# EAGLE schematic bs_prod (EAGLE 6.5.0)
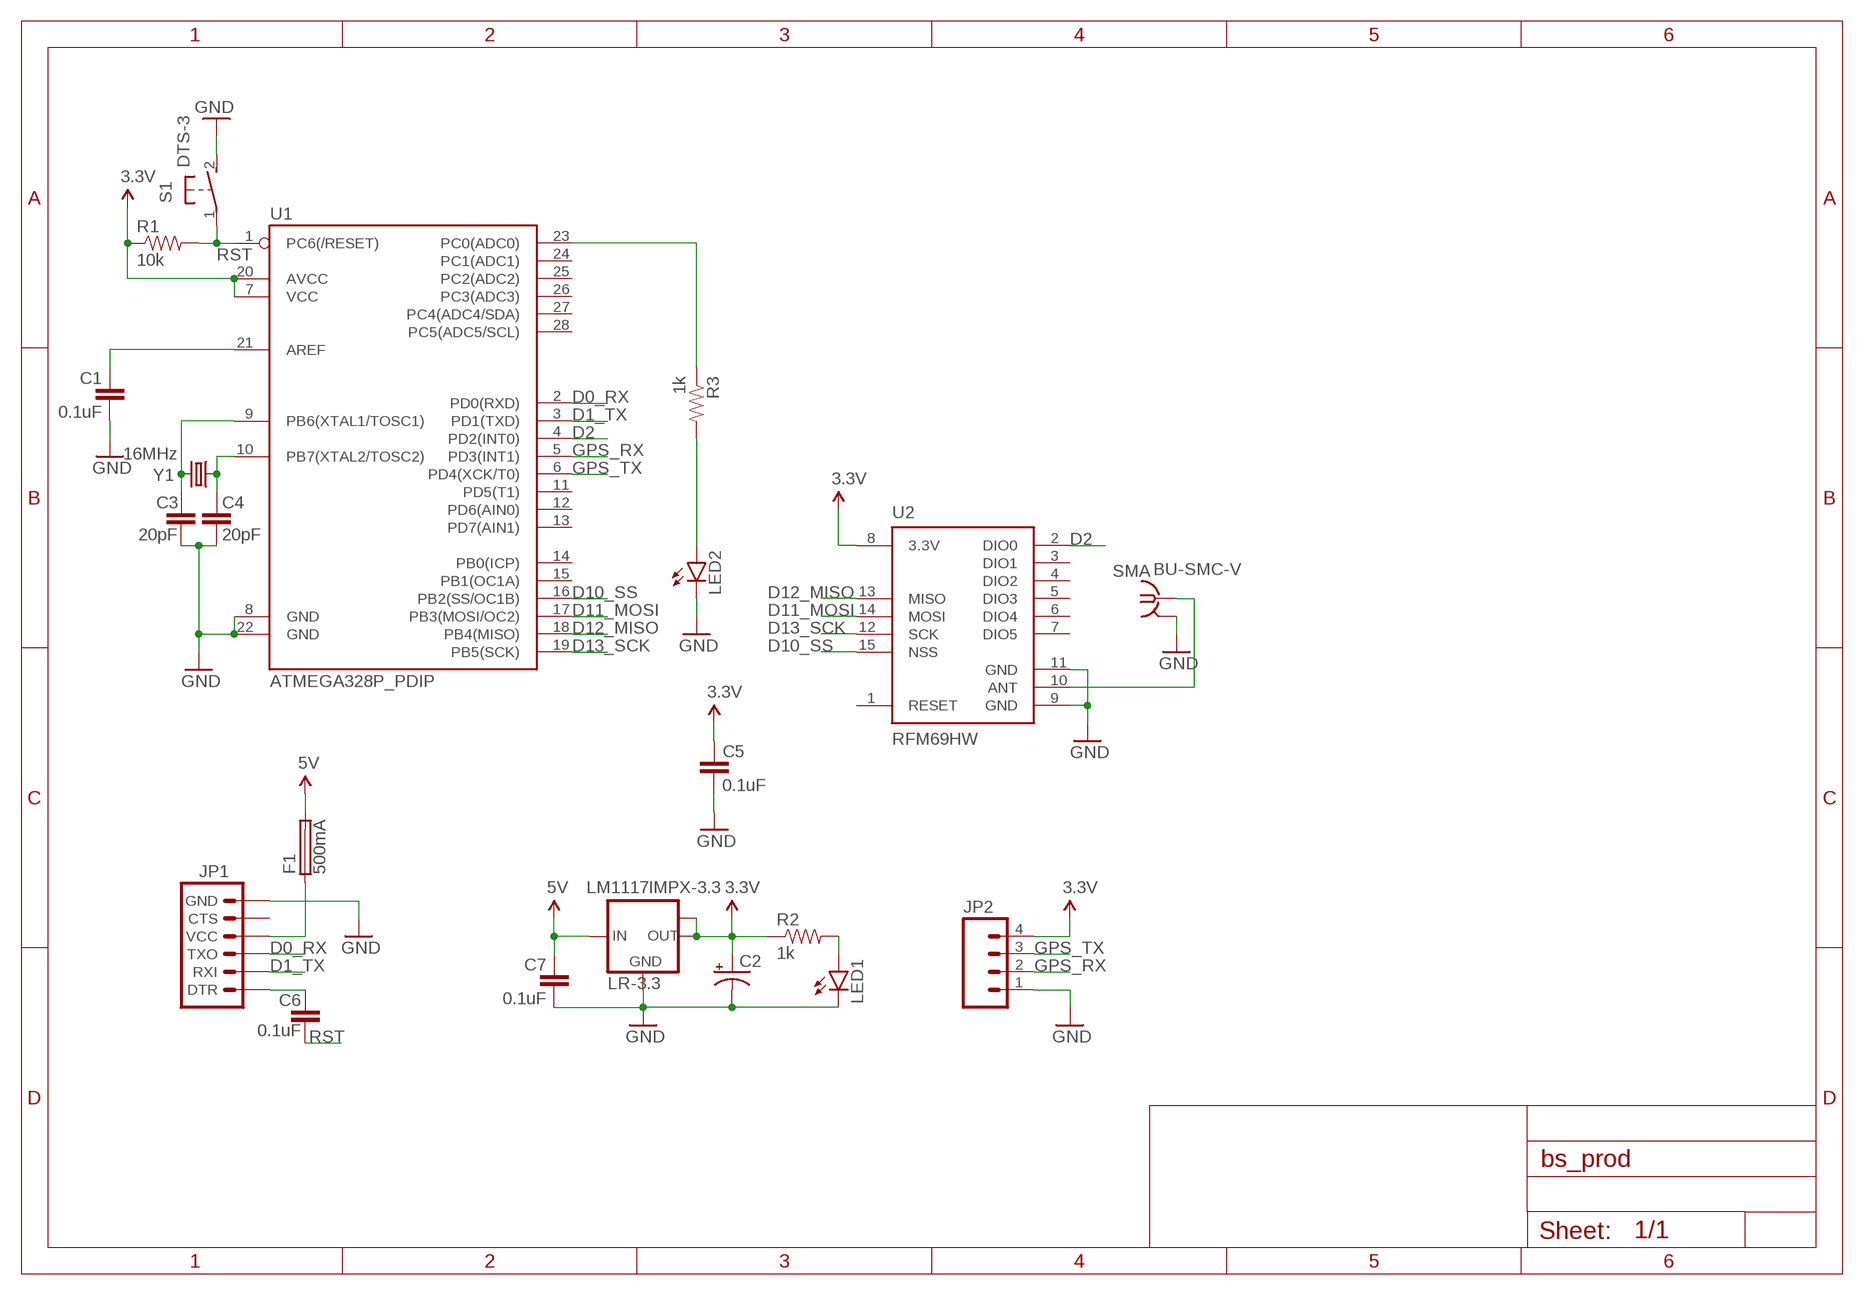
[diagram p0: schematic, sheet 1]

## Parts
C1  0.1uF  CAP1206  [1206]
C2  CAP_POLC  [PANASONIC_C]
C3  20pF  CAP1206  [1206]
C4  20pF  CAP1206  [1206]
C5  0.1uF  CAP1206  [1206]
C6  0.1uF  CAP1206  [1206]
C7  0.1uF  CAP1206  [1206]
F1  500mA  TE5  [TE5]
JP1  ARDUINO_SERIAL_PROGRAMPTH  [1X06]
JP2  M04PTH  [1X04]
LED1  LED1206  [LED-1206]
LED2  LED1206  [LED-1206]
LR-3.3  LM1117IMPX-3.3  [SOT223]
R1  10k  RESISTOR1206  [1206]
R2  1k  RESISTOR1206  [1206]
R3  1k  RESISTOR1206  [1206]
S1  DTS-3  [DTS-3]
SMA  BU-SMC-V  [BU-SMC-V]
U1  ATMEGA328P_PDIP  [DIL28-3]
U2  RFM69HW  [RFM69W-XXXS2]
Y1  16MHz  CRYSTALSMD  [HC49UP]

## Nets
3.3V: C2.+ C5.1 JP2.4 LR-3.3.2(OUT) LR-3.3.TAB(OUT1) R1.1 R2.1 U1.7(VCC) U1.20(AVCC) U2.8(3.3V)
5V: C7.1 F1.2 LR-3.3.3(IN)
D0_RX: JP1.3(TXO) U1.2(PD0(RXD))
D1_TX: JP1.2(RXI) U1.3(PD1(TXD))
D2: U1.4(PD2(INT0)) U2.2(DIO0)
D10_SS: U1.16(PB2(SS/OC1B)) U2.15(NSS)
D11_MOSI: U1.17(PB3(MOSI/OC2)) U2.14(MOSI)
D12_MISO: U1.18(PB4(MISO)) U2.13(MISO)
D13_SCK: U1.19(PB5(SCK)) U2.12(SCK)
GND: C1.2 C2.- C3.2 C4.2 C5.2 C7.2 JP1.6(GND) JP2.1 LED1.C LED2.C LR-3.3.1(GND) S1.2 SMA.2 SMA.3 SMA.4 SMA.5 U1.8(GND) U1.22(GND) U2.9(GND) U2.11(GND)
GPS_RX: JP2.2 U1.5(PD3(INT1))
GPS_TX: JP2.3 U1.6(PD4(XCK/T0))
N$5: LED1.A R2.2
N$6: C3.1 U1.9(PB6(XTAL1/TOSC1)) Y1.2
N$7: C4.1 U1.10(PB7(XTAL2/TOSC2)) Y1.1
N$8: SMA.1 U2.10(ANT)
N$9: F1.1 JP1.4(VCC)
N$11: C6.1 JP1.1(DTR)
N$12: R3.1 U1.23(PC0(ADC0))
N$13: LED2.A R3.2
N$16: C1.1 U1.21(AREF)
RST: C6.2 R1.2 S1.1 U1.1(PC6(/RESET))
Unconnected: JP1.5(CTS) U1.11(PD5(T1)) U1.12(PD6(AIN0)) U1.13(PD7(AIN1)) U1.14(PB0(ICP)) U1.15(PB1(OC1A)) U1.24(PC1(ADC1)) U1.25(PC2(ADC2)) U1.26(PC3(ADC3)) U1.27(PC4(ADC4/SDA)) U1.28(PC5(ADC5/SCL)) U2.1(RESET) U2.3(DIO1) U2.4(DIO2) U2.5(DIO3) U2.6(DIO4) U2.7(DIO5)

## Library data of the parts
C1 C3-C7 = SparkFun-Capacitors:CAP: Capacitor Standard 0603 ceramic capacitor, and 0.1" leaded capacitor.
C2 = SparkFun-Capacitors:CAP_POL: Capacitor Polarized These are standard SMD and PTH capacitors. Normally 10uF, 47uF, and 100uF in electrolytic and tantalum varieties. Always verify the external diameter of the through hole cap, it varies with capacity, voltage, and manufacturer. The EIA devices should be standard.
F1 = fuse:TE5: FUSE Wickmann; OC_FARNELL: unknown; OC_NEWARK: unknown
JP1 = SparkFun-Connectors:ARDUINO_SERIAL_PROGRAM: FTDI connector footprints
JP2 = SparkFun-Connectors:M04: Header 4 Standard 4-pin 0.1" header. Use with straight break away headers (SKU : PRT-00116), right angle break away headers (PRT-00553), swiss pins (PRT-00743), machine pins (PRT-00117), and female headers (PRT-00115). Molex polarized connector foot print use with SKU : PRT-08231 with associated crimp pins and housings. 1MM SMD Version SKU: PRT-10208
LED1 LED2 = SparkFun-LED:LED: LEDs Standard schematic elements and footprints for 5mm, 3mm, 1206, and 0603 sized LEDs. 5mm - Spark Fun Electronics SKU : COM-00529 (and others)
LR-3.3 = lm1117:LM1117IMPX-*
R1-R3 = SparkFun-Resistors:RESISTOR: Resistor Basic schematic elements and footprints for 0603, 1206, and PTH resistors.
S1 = switch-tact:DTS-3
SMA = con-coax:BU-SMC-V: FEMALE SMC CONNECTOR Radiall R112 426 distributor RS 295-5429; OC_FARNELL: unknown; OC_NEWARK: unknown
U1 = SparkFun-DigitalIC:ATMEGA328P_PDIP: uC used in the Arduino 32kb flash, 1k EEPROM, 2k SRAM This is the through-hole version of this chip.
U2 = SparkFun-RF:RFM69H
Y1 = SparkFun-FreqCtrl:CRYSTAL: Various standard crystals. Proven footprints. Spark Fun Electronics SKU : COM-00534